# Altium schematic sheet USB RGMII CONN.SchDoc: C-F-U-Bridge
size A3; ApprovedBy: Luca Schenetti; CheckedBy: Luca Schenetti; Author: Luca Schenetti; DrawnBy: Luca Schenetti; Revision: A; SheetNumber: 6; SheetTotal: 7
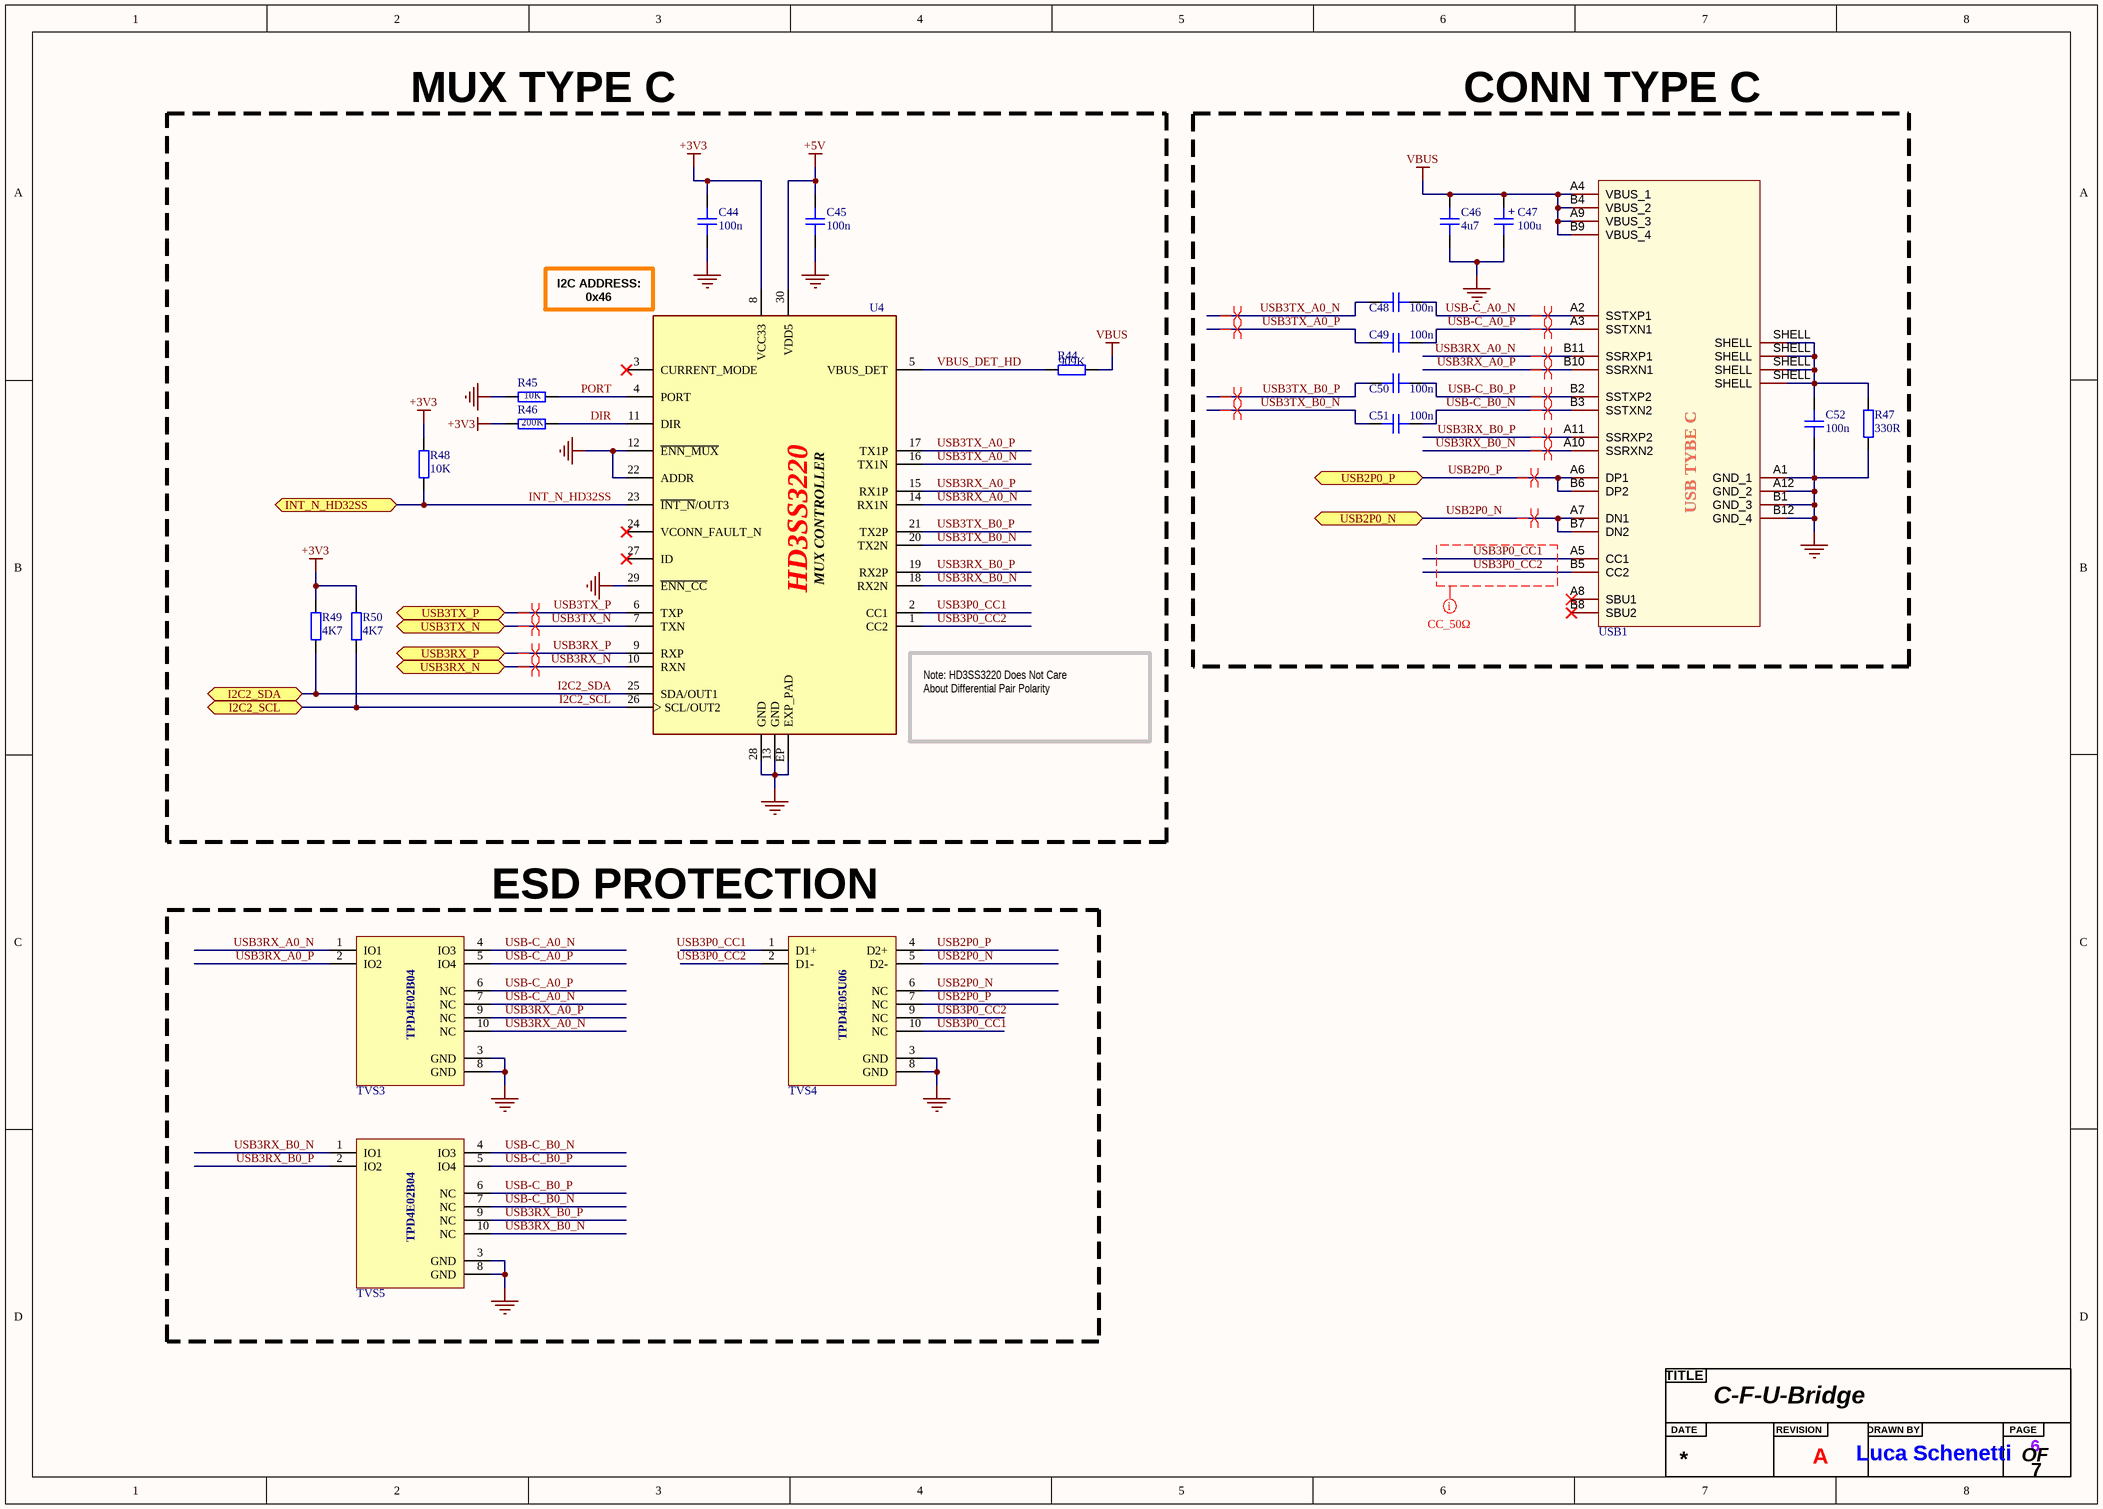
[diagram p0: USB RGMII CONN.SchDoc]

## Parts
?  Title  (value not drawn)  (graphical)
C44  100n  [CAP_0603]
C45  100n  [CAP_0603]
C46  4u7  [CAP_0805]
C47  100u  [CAP_AE_SMD_D6MM3_H5M55]
C48  100n  [CAP_0402]
C49  100n  [CAP_0402]
C50  100n  [CAP_0402]
C51  100n  [CAP_0402]
C52  100n  [CAP_0603]
R44  909K  [RES_0603]
R45  10K  [RES_0603]
R46  200K  [RES_0603]
R47  330R  [RES_0603]
R48  10K  [RES_0402]
R49  4K7  [RES_0402]
R50  4K7  [RES_0402]
TVS3  TVS DIODE USB 3  [TPD4E02B04DQAR]  (value not drawn)
TVS4  ESD and Surge Protection USB, HDMI & High Speed  [TPD4E05U06DQAR]  (value not drawn)
TVS5  TVS DIODE USB 3  [TPD4E02B04DQAR]  (value not drawn)
U4  USB Type-C MUX CONTROLLER  [HD3SS3220]  (value not drawn)
USB1  USB-C 24P SMD  [TYPE-C 24P QT 143]  (value not drawn)

## Blocks framed on the sheet
MUX TYPE C: C44 C45 R44-R46 R48-R50 U4
CONN TYPE C: C46-C52 R47 USB1
ESD PROTECTION: TVS3-TVS5

## Ports
I2C2_SCL (bidir, see STM32 MCU[4D]), I2C2_SDA (bidir, see STM32 MCU[4C]), INT_N_HD32SS (bidir, see STM32 MCU[2C]), USB2P0_N (bidir, see RGMII USB[6C]), USB2P0_P (bidir, see RGMII USB[6C]), USB3RX_N (bidir, see RGMII USB[6C]), USB3RX_P (bidir, see RGMII USB[6C]), USB3TX_N (bidir, see RGMII USB[6C]), USB3TX_P (bidir, see RGMII USB[6C])

## Nets
+3V3: C44.2 R46.1 R48.2 R49.2 R50.2 U4.8(VCC33)
+5V: C45.2 U4.30(VDD5)
GND: C44.1 C45.1 C46.1 C47.2 C52.1 R45.1 R47.1 TVS3.3(GND) TVS3.8(GND) TVS4.3(GND) TVS4.8(GND) TVS5.3(GND) TVS5.8(GND) U4.12(~{ENN_MUX}) U4.13(GND) U4.22(ADDR) U4.28(GND) U4.29(~{ENN_CC}) U4.EP(EXP_PAD) USB1.A1(GND_1) USB1.A12(GND_2) USB1.B1(GND_3) USB1.B12(GND_4)
VBUS: C46.2 C47.1 R44.2 USB1.A4(VBUS_1) USB1.A9(VBUS_3) USB1.B4(VBUS_2) USB1.B9(VBUS_4)
DIR: R46.2 U4.11(DIR)
I2C2_SCL: R50.1 U4.26(SCL/OUT2) ; port I2C2_SCL
I2C2_SDA: R49.1 U4.25(SDA/OUT1) ; port I2C2_SDA
INT_N_HD32SS: R48.1 U4.23(~{INT_N}/OUT3) ; port INT_N_HD32SS
PORT: R45.2 U4.4(PORT)
USB2P0_N: TVS4.5(D2-) TVS4.6(NC) USB1.A7(DN1) USB1.B7(DN2) ; port USB2P0_N
USB2P0_P: TVS4.4(D2+) TVS4.7(NC) USB1.A6(DP1) USB1.B6(DP2) ; port USB2P0_P
USB3P0_CC1: TVS4.1(D1+) TVS4.10(NC) U4.2(CC1) USB1.A5(CC1)
USB3P0_CC2: TVS4.2(D1-) TVS4.9(NC) U4.1(CC2) USB1.B5(CC2)
USB3RX_A0_N: TVS3.1(IO1) TVS3.10(NC) U4.14(RX1N) USB1.B11(SSRXP1)
USB3RX_A0_P: TVS3.2(IO2) TVS3.9(NC) U4.15(RX1P) USB1.B10(SSRXN1)
USB3RX_B0_N: TVS5.1(IO1) TVS5.10(NC) U4.18(RX2N) USB1.A10(SSRXN2)
USB3RX_B0_P: TVS5.2(IO2) TVS5.9(NC) U4.19(RX2P) USB1.A11(SSRXP2)
USB3RX_N: U4.10(RXN) ; port USB3RX_N
USB3RX_P: U4.9(RXP) ; port USB3RX_P
USB3TX_A0_N: C48.1 U4.16(TX1N)
USB3TX_A0_P: C49.1 U4.17(TX1P)
USB3TX_B0_N: C51.1 U4.20(TX2N)
USB3TX_B0_P: C50.1 U4.21(TX2P)
USB3TX_N: U4.7(TXN) ; port USB3TX_N
USB3TX_P: U4.6(TXP) ; port USB3TX_P
USB-C_A0_N: C48.2 TVS3.4(IO3) TVS3.7(NC) USB1.A2(SSTXP1)
USB-C_A0_P: C49.2 TVS3.5(IO4) TVS3.6(NC) USB1.A3(SSTXN1)
USB-C_B0_N: C51.2 TVS5.4(IO3) TVS5.7(NC) USB1.B3(SSTXN2)
USB-C_B0_P: C50.2 TVS5.5(IO4) TVS5.6(NC) USB1.B2(SSTXP2)
VBUS_DET_HD: R44.1 U4.5(VBUS_DET)
NetC52_2: C52.2 R47.2 USB1.SHELL

Not connected (* = marked no-connect by the designer): U4 3(CURRENT_MODE)* 24(VCONN_FAULT_N)* 27(ID)*; USB1 A8(SBU1)* B8(SBU2)*

## Layout directives
net class CC_50Ω: USB3P0_CC1, USB3P0_CC2
differential pair; differential pair class DIFF_USB_90Ω; rule Matched Net Lengths [Delay Tolerance = 5ps]: USB3RX_A0_N, USB3RX_A0_P, USB3RX_B0_N, USB3RX_B0_P, USB3RX_N, USB3RX_P, USB3TX_A0_N, USB3TX_A0_P, USB3TX_B0_N, USB3TX_B0_P, USB3TX_N, USB3TX_P, USB-C_A0_N, USB-C_A0_P, USB-C_B0_N, USB-C_B0_P
differential pair; differential pair class DIFF_USB_90Ω; rule Matched Net Lengths [Delay Tolerance = 100ps]: USB2P0_N, USB2P0_P

## Notes on the sheet
- (near U4) I2C ADDRESS:
  0x46
- (near U4) Note: HD3SS3220 Does Not Care
  About Differential Pair Polarity
- (in symbol CAP_ALEL_6.3x5.5) +
- (in symbol HD3SS3220RNHR) HD3SS3220; MUX CONTROLLER
- (in symbol Title) TITLE; DATE; REVISION; DRAWN BY; PAGE; OF
- (in symbol TPD4E02B04DQAR) TPD4E02B04
- (in symbol TPD4E05U06DQAR) TPD4E05U06
- (in symbol USB-C 24P) USB TYBE C

## Library data of the parts
C44 C45 = CAP_0603: [C14663]; Manufacturer: *; Manufacturer Part Number: *; Distributor Link: *; LCSC: *; Rating: *; Dielectric: *
C46 = CAP_0805: [C1779]; Manufacturer: *; Manufacturer Part Number: *; Distributor Link: *; LCSC: *; Rating: *; Dielectric: *
C47 = CAP_ALEL_6.3x5.5: [C59936]; Manufacturer: *; Manufacturer Part Number: *; Distributor Link: *; LCSC: *
C48-C51 = CAP_0402: Capacitor SMD 0402[C1525]; Manufacturer: *; Manufacturer Part Number: *; Distributor Link: *; LCSC: *; Rating: *; Dielectric: *
C52 = CAP_0603: Capacitor SMD 0603 [C14663]; Manufacturer: *; Manufacturer Part Number: *; Distributor Link: *; LCSC: *; Rating: *; Dielectric: *
R44 = RES_0603: [C403391]; Manufacturer: *; Manufacturer Part Number: *; Distributor Link: *; LCSC: *
R45 = RES_0603: [C25804]; Manufacturer: *; Manufacturer Part Number: *; Distributor Link: *; LCSC: *
R46 = RES_0603: [C25811]; Manufacturer: *; Manufacturer Part Number: *; Distributor Link: *; LCSC: *
R47 = RES_0603: [C23138]; Manufacturer: *; Manufacturer Part Number: *; Distributor Link: *; LCSC: *
R48 = RES_0402: [C25744]; Manufacturer: *; Manufacturer Part Number: *; Distributor Link: *; LCSC: *
R49 R50 = RES_0402: [C23162]; Manufacturer: *; Manufacturer Part Number: *; Distributor Link: *; LCSC: *
TVS3 TVS5 = TPD4E02B04DQAR: [C106794]
TVS4 = TPD4E05U06DQAR: [C138714]
U4 = HD3SS3220RNHR: [C165155]
USB1 = USB-C 24P: [C5156605]